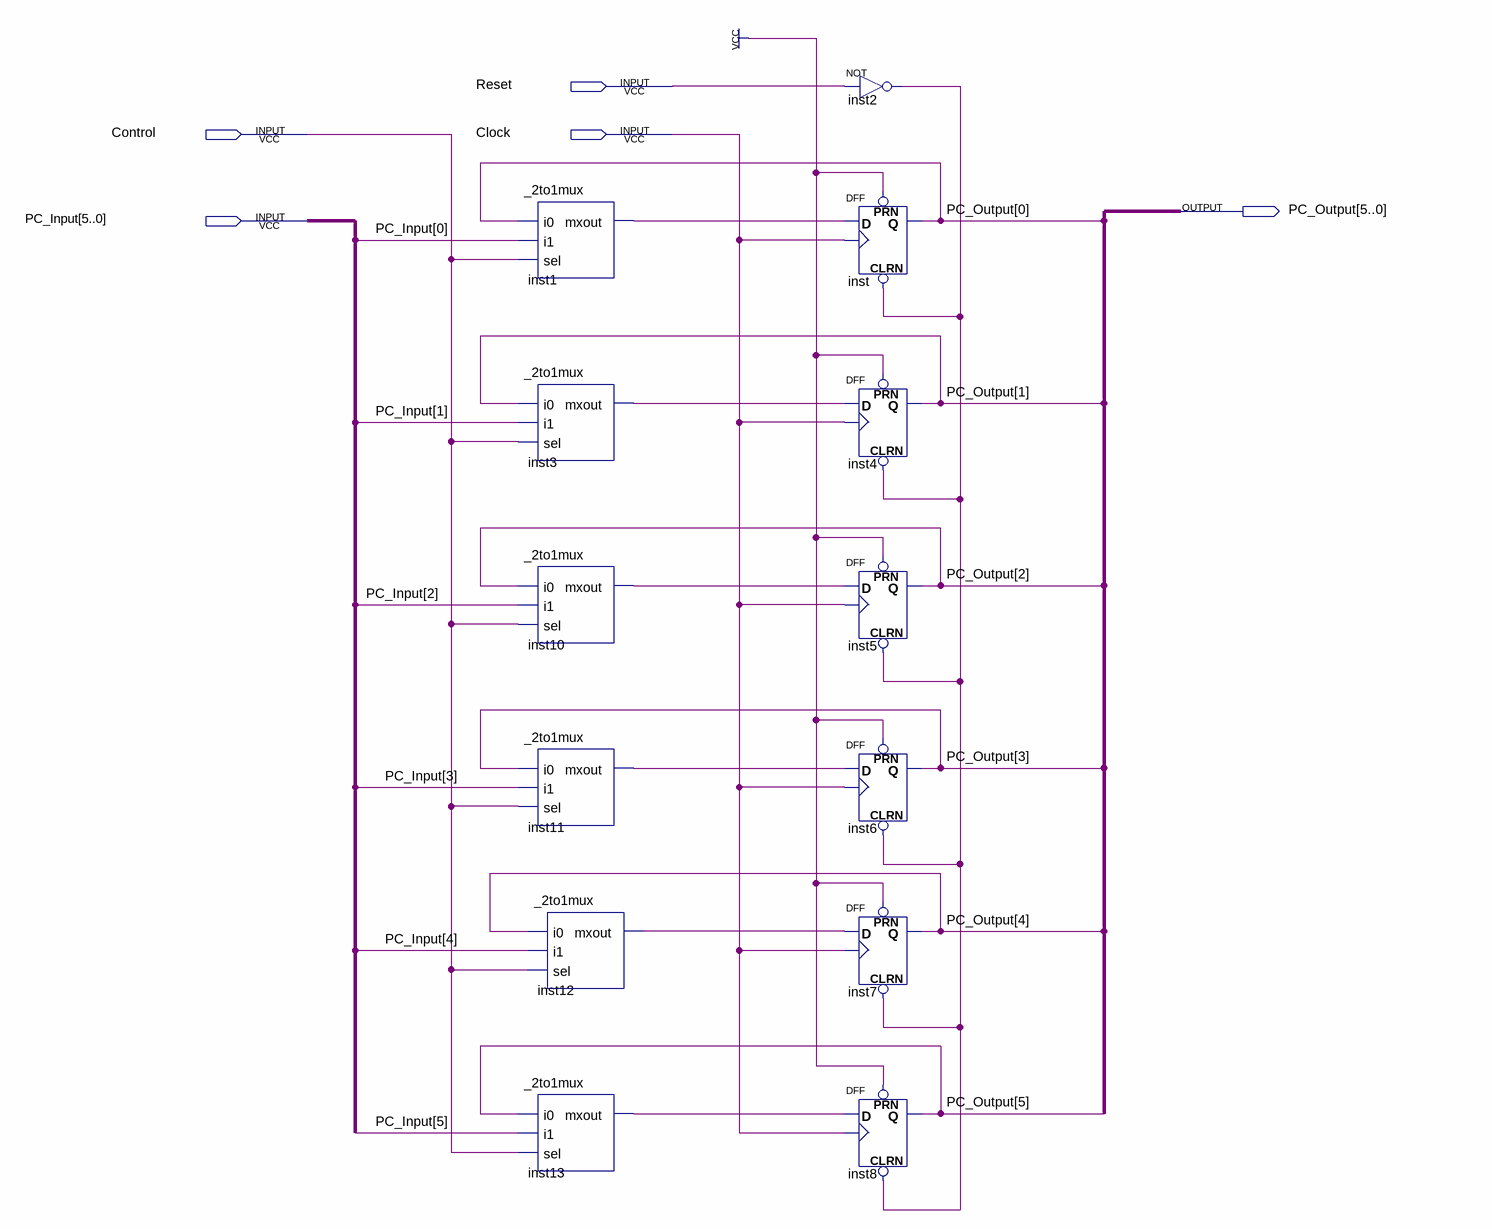
[diagram p0: schematic sheet]
// Quartus schematic ProgramCounter.bdf as structural Verilog: 13 symbols, 5 pins
module ProgramCounter (
  input  Reset,
  input  Control,
  input  Clock,
  input  [5:0] PC_Input,
  output [5:0] PC_Output
);

  wire inst1_mxout, inst2_out, inst3_mxout, inst10_mxout, inst11_mxout, inst12_mxout, inst13_mxout;

  _2to1mux inst1 (.i0(PC_Output[0]), .i1(PC_Input[0]), .sel(Control), .mxout(inst1_mxout));
  _2to1mux inst3 (.i0(PC_Output[1]), .i1(PC_Input[1]), .sel(Control), .mxout(inst3_mxout));
  _2to1mux inst10 (.i0(PC_Output[2]), .i1(PC_Input[2]), .sel(Control), .mxout(inst10_mxout));
  _2to1mux inst11 (.i0(PC_Output[3]), .i1(PC_Input[3]), .sel(Control), .mxout(inst11_mxout));
  _2to1mux inst12 (.i0(PC_Output[4]), .i1(PC_Input[4]), .sel(Control), .mxout(inst12_mxout));
  _2to1mux inst13 (.i0(PC_Output[5]), .i1(PC_Input[5]), .sel(Control), .mxout(inst13_mxout));
  not inst2 (inst2_out, Reset);
  DFF inst (.CLRN(inst2_out), .CLK(Clock), .D(inst1_mxout), .PRN(1'b1), .Q(PC_Output[0]));
  DFF inst4 (.CLRN(inst2_out), .CLK(Clock), .D(inst3_mxout), .PRN(1'b1), .Q(PC_Output[1]));
  DFF inst5 (.CLRN(inst2_out), .CLK(Clock), .D(inst10_mxout), .PRN(1'b1), .Q(PC_Output[2]));
  DFF inst6 (.CLRN(inst2_out), .CLK(Clock), .D(inst11_mxout), .PRN(1'b1), .Q(PC_Output[3]));
  DFF inst7 (.CLRN(inst2_out), .CLK(Clock), .D(inst12_mxout), .PRN(1'b1), .Q(PC_Output[4]));
  DFF inst8 (.CLRN(inst2_out), .CLK(Clock), .D(inst13_mxout), .PRN(1'b1), .Q(PC_Output[5]));
endmodule
